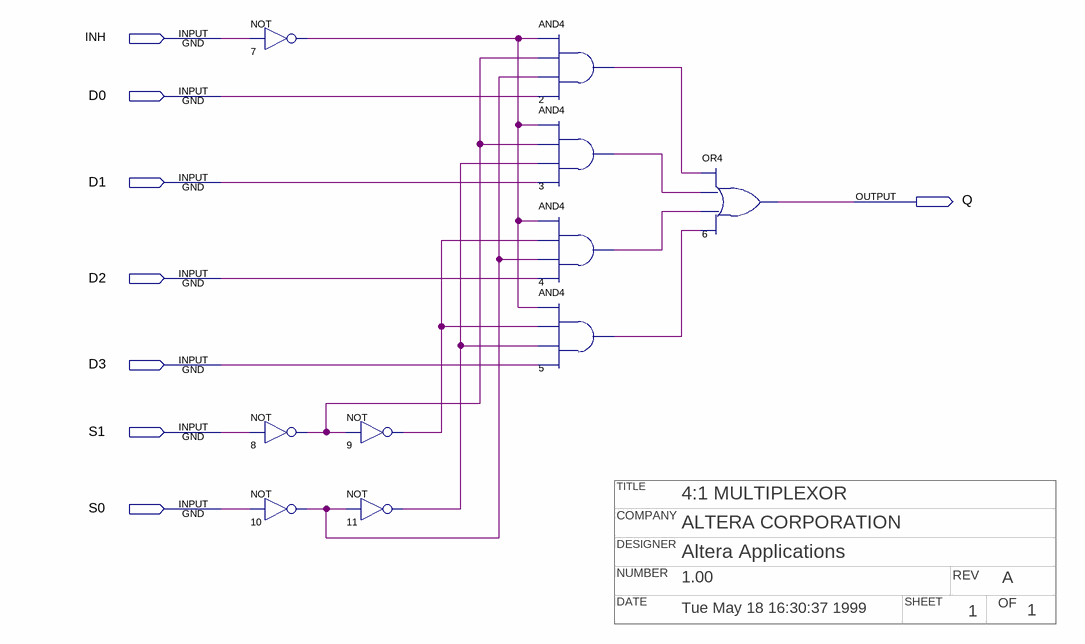
[diagram p0: schematic sheet]
// Quartus schematic mux41.bdf as structural Verilog: 10 symbols, 8 pins
// Title block: TITLE: 4:1 MULTIPLEXOR; COMPANY: ALTERA CORPORATION; DESIGNER: Altera Applications; NUMBER: 1.00; REV: A; DATE: Tue May 18 16:30:37 1999; SHEET: 1; OF: 1
module mux41 (
  input  INH,
  input  D0,
  input  D1,
  input  D2,
  input  D3,
  input  S1,
  input  S0,
  output Q
);

  wire n2_out, n3_out, n4_out, n5_out, n7_out, n8_out, n9_out, n10_out, n11_out;

  not u_7 (n7_out, INH);
  not u_8 (n8_out, S1);
  not u_10 (n10_out, S0);
  not u_9 (n9_out, n8_out);
  not u_11 (n11_out, n10_out);
  and u_2 (n2_out, n7_out, n8_out, n10_out, D0);
  and u_3 (n3_out, n7_out, n8_out, n11_out, D1);
  and u_4 (n4_out, n7_out, n9_out, n10_out, D2);
  and u_5 (n5_out, n7_out, n9_out, n11_out, D3);
  or u_6 (Q, n2_out, n3_out, n4_out, n5_out);
endmodule
